# EAGLE schematic UCirKitBreadboardWithEverything2Top (EAGLE 7.3.0)
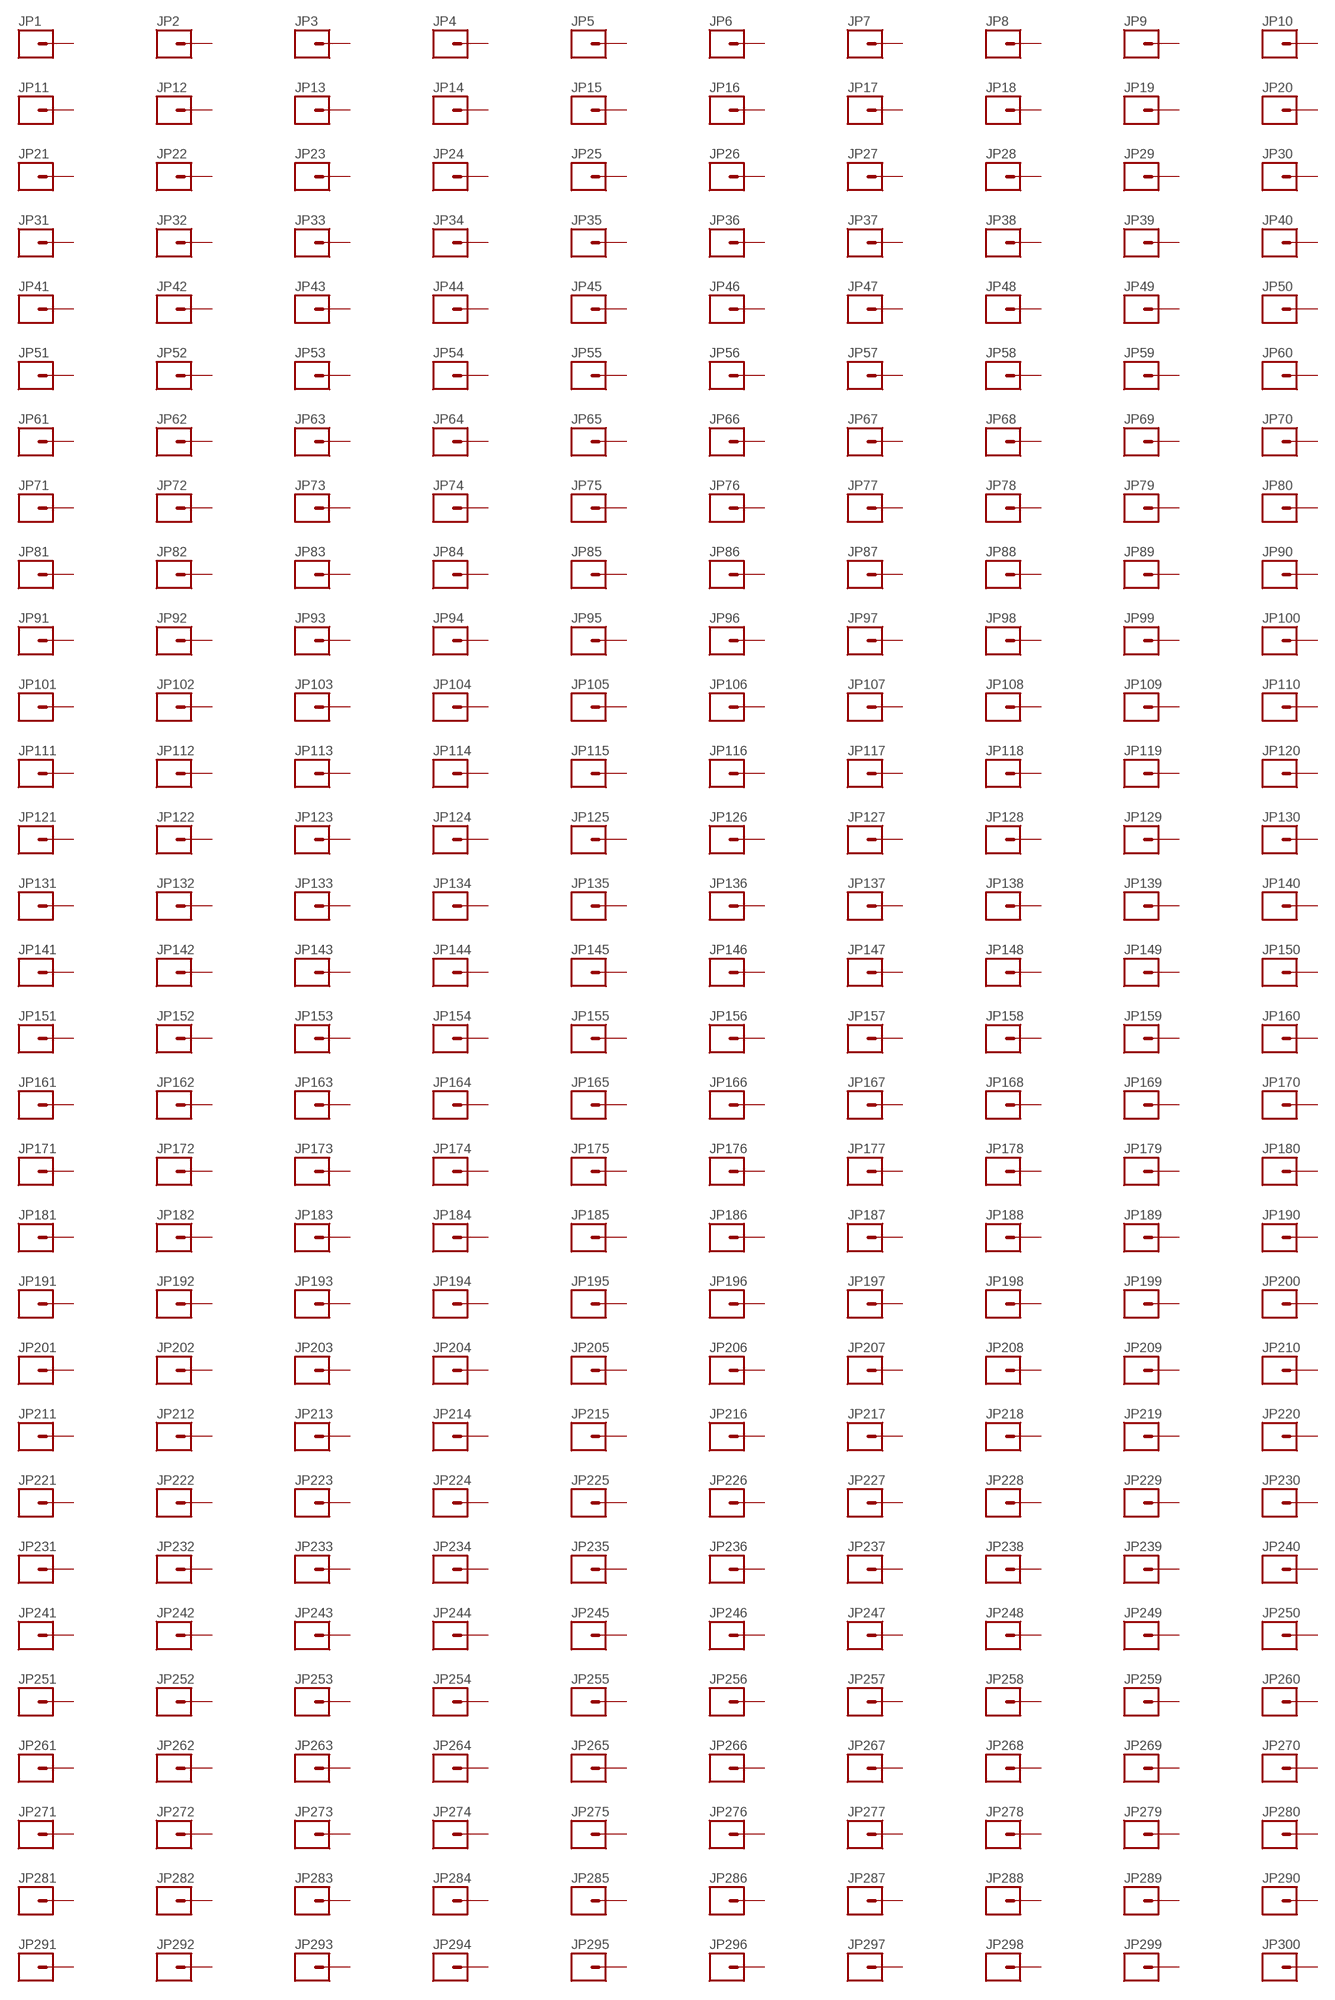
[diagram p0: schematic, sheet 1, part 1 of 2]
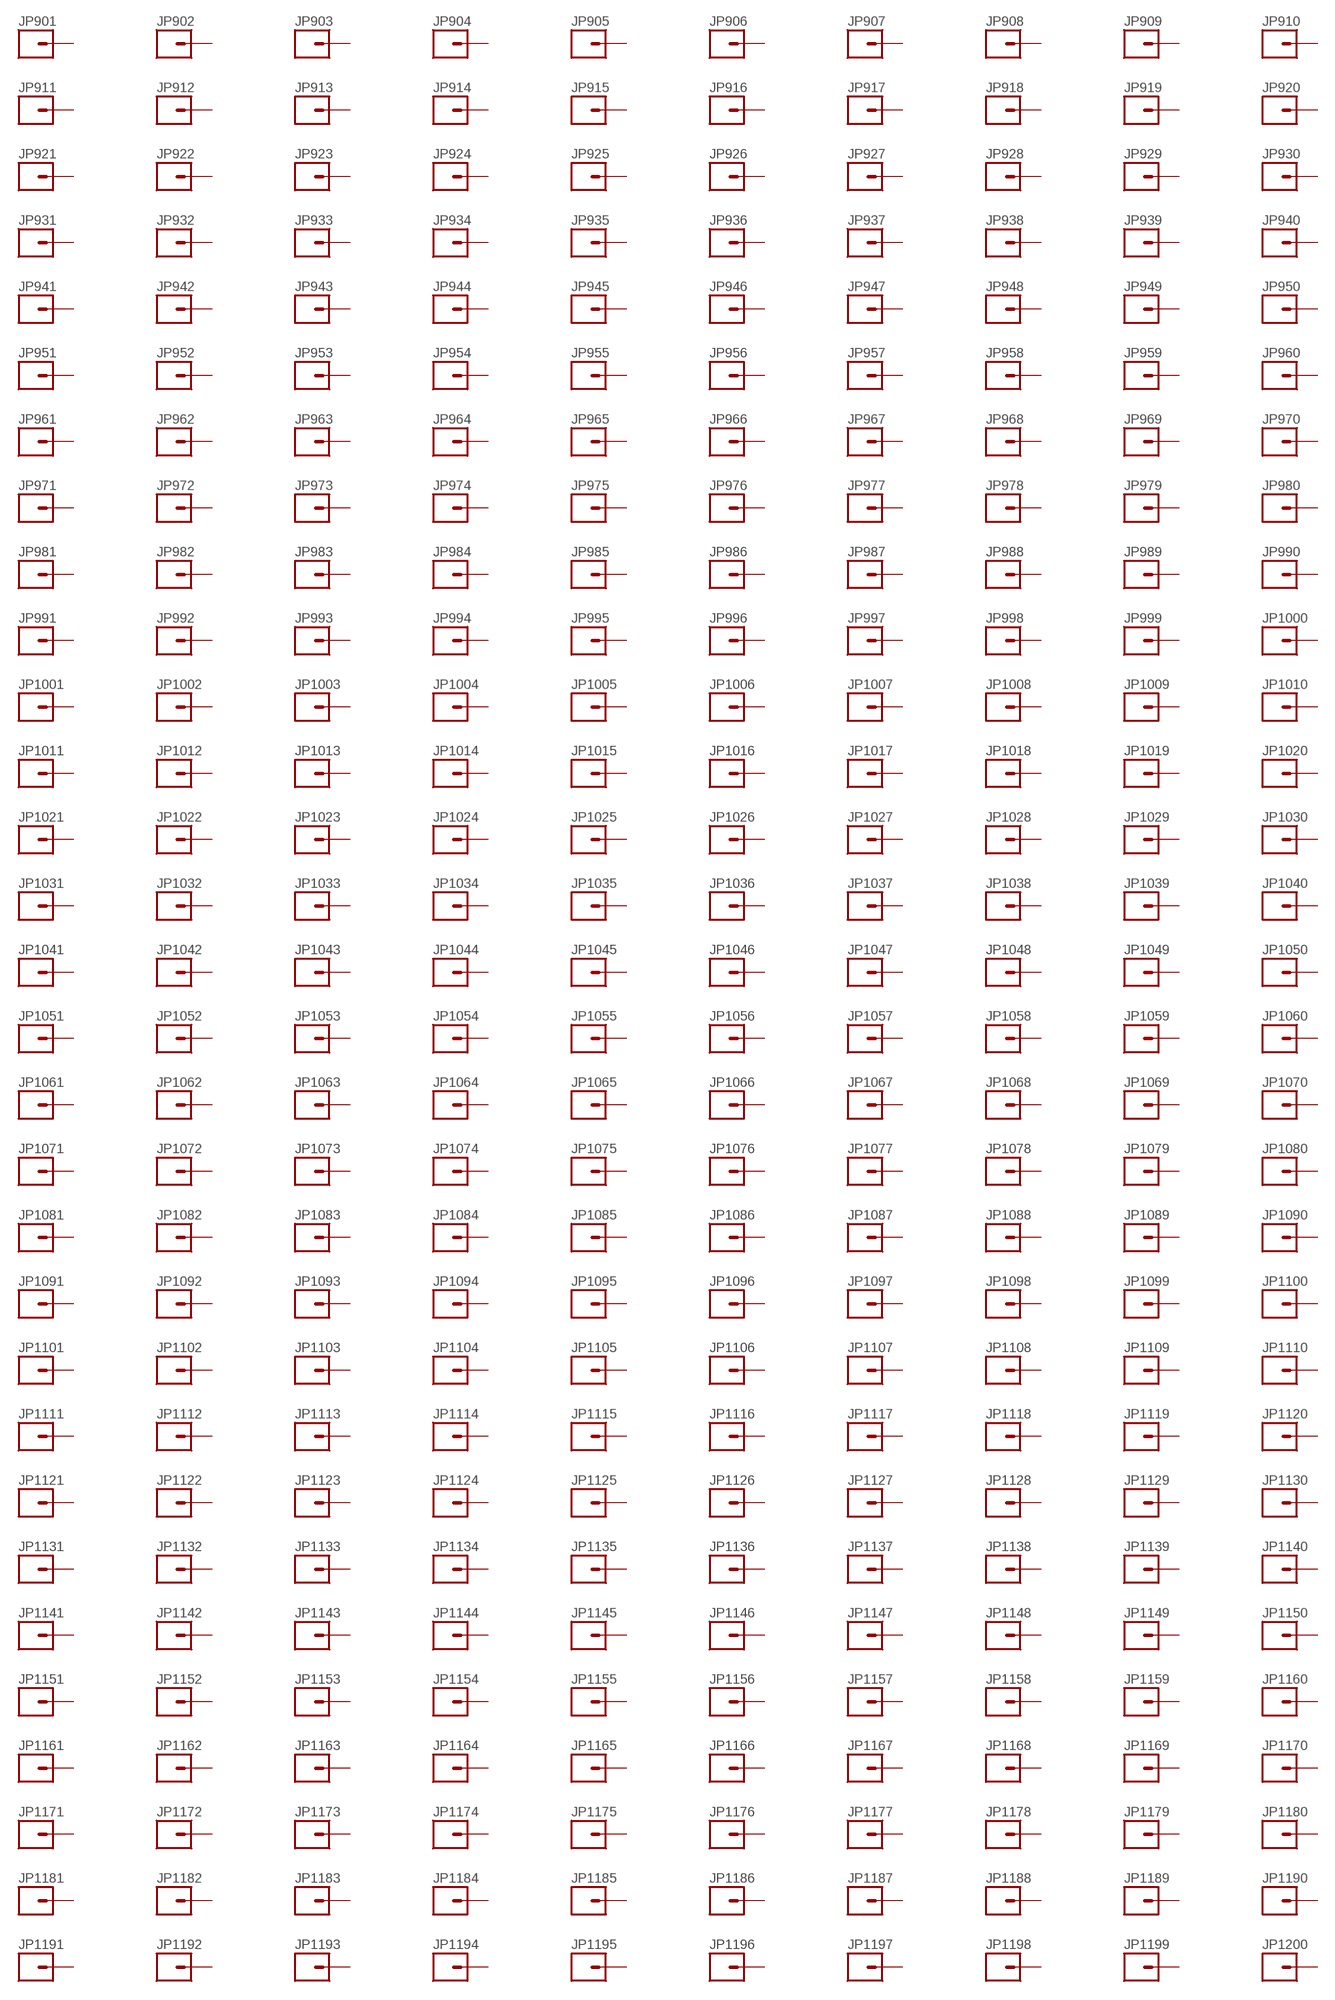
[diagram p1: schematic, sheet 1, part 2 of 2]

## Parts
JP1  M01PTH_WITHOUT_TEXT  [1X01_WITHOUT_TEXT]
JP2  M01PTH_WITHOUT_TEXT  [1X01_WITHOUT_TEXT]
JP3  M01PTH_WITHOUT_TEXT  [1X01_WITHOUT_TEXT]
JP4  M01PTH_WITHOUT_TEXT  [1X01_WITHOUT_TEXT]
JP5  M01PTH_WITHOUT_TEXT  [1X01_WITHOUT_TEXT]
JP6  M01PTH_WITHOUT_TEXT  [1X01_WITHOUT_TEXT]
JP7  M01PTH_WITHOUT_TEXT  [1X01_WITHOUT_TEXT]
JP8  M01PTH_WITHOUT_TEXT  [1X01_WITHOUT_TEXT]
JP9  M01PTH_WITHOUT_TEXT  [1X01_WITHOUT_TEXT]
JP10  M01PTH_WITHOUT_TEXT  [1X01_WITHOUT_TEXT]
JP11  M01PTH_WITHOUT_TEXT  [1X01_WITHOUT_TEXT]
JP12  M01PTH_WITHOUT_TEXT  [1X01_WITHOUT_TEXT]
JP13  M01PTH_WITHOUT_TEXT  [1X01_WITHOUT_TEXT]
JP14  M01PTH_WITHOUT_TEXT  [1X01_WITHOUT_TEXT]
JP15  M01PTH_WITHOUT_TEXT  [1X01_WITHOUT_TEXT]
JP16  M01PTH_WITHOUT_TEXT  [1X01_WITHOUT_TEXT]
JP17  M01PTH_WITHOUT_TEXT  [1X01_WITHOUT_TEXT]
JP18  M01PTH_WITHOUT_TEXT  [1X01_WITHOUT_TEXT]
JP19  M01PTH_WITHOUT_TEXT  [1X01_WITHOUT_TEXT]
JP20  M01PTH_WITHOUT_TEXT  [1X01_WITHOUT_TEXT]
JP21  M01PTH_WITHOUT_TEXT  [1X01_WITHOUT_TEXT]
JP22  M01PTH_WITHOUT_TEXT  [1X01_WITHOUT_TEXT]
JP23  M01PTH_WITHOUT_TEXT  [1X01_WITHOUT_TEXT]
JP24  M01PTH_WITHOUT_TEXT  [1X01_WITHOUT_TEXT]
JP25  M01PTH_WITHOUT_TEXT  [1X01_WITHOUT_TEXT]
JP26  M01PTH_WITHOUT_TEXT  [1X01_WITHOUT_TEXT]
JP27  M01PTH_WITHOUT_TEXT  [1X01_WITHOUT_TEXT]
JP28  M01PTH_WITHOUT_TEXT  [1X01_WITHOUT_TEXT]
JP29  M01PTH_WITHOUT_TEXT  [1X01_WITHOUT_TEXT]
JP30  M01PTH_WITHOUT_TEXT  [1X01_WITHOUT_TEXT]
JP31  M01PTH_WITHOUT_TEXT  [1X01_WITHOUT_TEXT]
JP32  M01PTH_WITHOUT_TEXT  [1X01_WITHOUT_TEXT]
JP33  M01PTH_WITHOUT_TEXT  [1X01_WITHOUT_TEXT]
JP34  M01PTH_WITHOUT_TEXT  [1X01_WITHOUT_TEXT]
JP35  M01PTH_WITHOUT_TEXT  [1X01_WITHOUT_TEXT]
JP36  M01PTH_WITHOUT_TEXT  [1X01_WITHOUT_TEXT]
JP37  M01PTH_WITHOUT_TEXT  [1X01_WITHOUT_TEXT]
JP38  M01PTH_WITHOUT_TEXT  [1X01_WITHOUT_TEXT]
JP39  M01PTH_WITHOUT_TEXT  [1X01_WITHOUT_TEXT]
JP40  M01PTH_WITHOUT_TEXT  [1X01_WITHOUT_TEXT]
JP41  M01PTH_WITHOUT_TEXT  [1X01_WITHOUT_TEXT]
JP42  M01PTH_WITHOUT_TEXT  [1X01_WITHOUT_TEXT]
JP43  M01PTH_WITHOUT_TEXT  [1X01_WITHOUT_TEXT]
JP44  M01PTH_WITHOUT_TEXT  [1X01_WITHOUT_TEXT]
JP45  M01PTH_WITHOUT_TEXT  [1X01_WITHOUT_TEXT]
JP46  M01PTH_WITHOUT_TEXT  [1X01_WITHOUT_TEXT]
JP47  M01PTH_WITHOUT_TEXT  [1X01_WITHOUT_TEXT]
JP48  M01PTH_WITHOUT_TEXT  [1X01_WITHOUT_TEXT]
JP49  M01PTH_WITHOUT_TEXT  [1X01_WITHOUT_TEXT]
JP50  M01PTH_WITHOUT_TEXT  [1X01_WITHOUT_TEXT]
JP51  M01PTH_WITHOUT_TEXT  [1X01_WITHOUT_TEXT]
JP52  M01PTH_WITHOUT_TEXT  [1X01_WITHOUT_TEXT]
JP53  M01PTH_WITHOUT_TEXT  [1X01_WITHOUT_TEXT]
JP54  M01PTH_WITHOUT_TEXT  [1X01_WITHOUT_TEXT]
JP55  M01PTH_WITHOUT_TEXT  [1X01_WITHOUT_TEXT]
JP56  M01PTH_WITHOUT_TEXT  [1X01_WITHOUT_TEXT]
JP57  M01PTH_WITHOUT_TEXT  [1X01_WITHOUT_TEXT]
JP58  M01PTH_WITHOUT_TEXT  [1X01_WITHOUT_TEXT]
JP59  M01PTH_WITHOUT_TEXT  [1X01_WITHOUT_TEXT]
JP60  M01PTH_WITHOUT_TEXT  [1X01_WITHOUT_TEXT]
JP61  M01PTH_WITHOUT_TEXT  [1X01_WITHOUT_TEXT]
JP62  M01PTH_WITHOUT_TEXT  [1X01_WITHOUT_TEXT]
JP63  M01PTH_WITHOUT_TEXT  [1X01_WITHOUT_TEXT]
JP64  M01PTH_WITHOUT_TEXT  [1X01_WITHOUT_TEXT]
JP65  M01PTH_WITHOUT_TEXT  [1X01_WITHOUT_TEXT]
JP66  M01PTH_WITHOUT_TEXT  [1X01_WITHOUT_TEXT]
JP67  M01PTH_WITHOUT_TEXT  [1X01_WITHOUT_TEXT]
JP68  M01PTH_WITHOUT_TEXT  [1X01_WITHOUT_TEXT]
JP69  M01PTH_WITHOUT_TEXT  [1X01_WITHOUT_TEXT]
JP70  M01PTH_WITHOUT_TEXT  [1X01_WITHOUT_TEXT]
JP71  M01PTH_WITHOUT_TEXT  [1X01_WITHOUT_TEXT]
JP72  M01PTH_WITHOUT_TEXT  [1X01_WITHOUT_TEXT]
JP73  M01PTH_WITHOUT_TEXT  [1X01_WITHOUT_TEXT]
JP74  M01PTH_WITHOUT_TEXT  [1X01_WITHOUT_TEXT]
JP75  M01PTH_WITHOUT_TEXT  [1X01_WITHOUT_TEXT]
JP76  M01PTH_WITHOUT_TEXT  [1X01_WITHOUT_TEXT]
JP77  M01PTH_WITHOUT_TEXT  [1X01_WITHOUT_TEXT]
JP78  M01PTH_WITHOUT_TEXT  [1X01_WITHOUT_TEXT]
JP79  M01PTH_WITHOUT_TEXT  [1X01_WITHOUT_TEXT]
JP80  M01PTH_WITHOUT_TEXT  [1X01_WITHOUT_TEXT]
JP81  M01PTH_WITHOUT_TEXT  [1X01_WITHOUT_TEXT]
JP82  M01PTH_WITHOUT_TEXT  [1X01_WITHOUT_TEXT]
JP83  M01PTH_WITHOUT_TEXT  [1X01_WITHOUT_TEXT]
JP84  M01PTH_WITHOUT_TEXT  [1X01_WITHOUT_TEXT]
JP85  M01PTH_WITHOUT_TEXT  [1X01_WITHOUT_TEXT]
JP86  M01PTH_WITHOUT_TEXT  [1X01_WITHOUT_TEXT]
JP87  M01PTH_WITHOUT_TEXT  [1X01_WITHOUT_TEXT]
JP88  M01PTH_WITHOUT_TEXT  [1X01_WITHOUT_TEXT]
JP89  M01PTH_WITHOUT_TEXT  [1X01_WITHOUT_TEXT]
JP90  M01PTH_WITHOUT_TEXT  [1X01_WITHOUT_TEXT]
JP91  M01PTH_WITHOUT_TEXT  [1X01_WITHOUT_TEXT]
JP92  M01PTH_WITHOUT_TEXT  [1X01_WITHOUT_TEXT]
JP93  M01PTH_WITHOUT_TEXT  [1X01_WITHOUT_TEXT]
JP94  M01PTH_WITHOUT_TEXT  [1X01_WITHOUT_TEXT]
JP95  M01PTH_WITHOUT_TEXT  [1X01_WITHOUT_TEXT]
JP96  M01PTH_WITHOUT_TEXT  [1X01_WITHOUT_TEXT]
JP97  M01PTH_WITHOUT_TEXT  [1X01_WITHOUT_TEXT]
JP98  M01PTH_WITHOUT_TEXT  [1X01_WITHOUT_TEXT]
JP99  M01PTH_WITHOUT_TEXT  [1X01_WITHOUT_TEXT]
JP100  M01PTH_WITHOUT_TEXT  [1X01_WITHOUT_TEXT]
JP101  M01PTH_WITHOUT_TEXT  [1X01_WITHOUT_TEXT]
JP102  M01PTH_WITHOUT_TEXT  [1X01_WITHOUT_TEXT]
JP103  M01PTH_WITHOUT_TEXT  [1X01_WITHOUT_TEXT]
JP104  M01PTH_WITHOUT_TEXT  [1X01_WITHOUT_TEXT]
JP105  M01PTH_WITHOUT_TEXT  [1X01_WITHOUT_TEXT]
JP106  M01PTH_WITHOUT_TEXT  [1X01_WITHOUT_TEXT]
JP107  M01PTH_WITHOUT_TEXT  [1X01_WITHOUT_TEXT]
JP108  M01PTH_WITHOUT_TEXT  [1X01_WITHOUT_TEXT]
JP109  M01PTH_WITHOUT_TEXT  [1X01_WITHOUT_TEXT]
JP110  M01PTH_WITHOUT_TEXT  [1X01_WITHOUT_TEXT]
JP111  M01PTH_WITHOUT_TEXT  [1X01_WITHOUT_TEXT]
JP112  M01PTH_WITHOUT_TEXT  [1X01_WITHOUT_TEXT]
JP113  M01PTH_WITHOUT_TEXT  [1X01_WITHOUT_TEXT]
JP114  M01PTH_WITHOUT_TEXT  [1X01_WITHOUT_TEXT]
JP115  M01PTH_WITHOUT_TEXT  [1X01_WITHOUT_TEXT]
JP116  M01PTH_WITHOUT_TEXT  [1X01_WITHOUT_TEXT]
JP117  M01PTH_WITHOUT_TEXT  [1X01_WITHOUT_TEXT]
JP118  M01PTH_WITHOUT_TEXT  [1X01_WITHOUT_TEXT]
JP119  M01PTH_WITHOUT_TEXT  [1X01_WITHOUT_TEXT]
JP120  M01PTH_WITHOUT_TEXT  [1X01_WITHOUT_TEXT]
JP121  M01PTH_WITHOUT_TEXT  [1X01_WITHOUT_TEXT]
JP122  M01PTH_WITHOUT_TEXT  [1X01_WITHOUT_TEXT]
JP123  M01PTH_WITHOUT_TEXT  [1X01_WITHOUT_TEXT]
JP124  M01PTH_WITHOUT_TEXT  [1X01_WITHOUT_TEXT]
JP125  M01PTH_WITHOUT_TEXT  [1X01_WITHOUT_TEXT]
JP126  M01PTH_WITHOUT_TEXT  [1X01_WITHOUT_TEXT]
JP127  M01PTH_WITHOUT_TEXT  [1X01_WITHOUT_TEXT]
JP128  M01PTH_WITHOUT_TEXT  [1X01_WITHOUT_TEXT]
JP129  M01PTH_WITHOUT_TEXT  [1X01_WITHOUT_TEXT]
JP130  M01PTH_WITHOUT_TEXT  [1X01_WITHOUT_TEXT]
JP131  M01PTH_WITHOUT_TEXT  [1X01_WITHOUT_TEXT]
JP132  M01PTH_WITHOUT_TEXT  [1X01_WITHOUT_TEXT]
JP133  M01PTH_WITHOUT_TEXT  [1X01_WITHOUT_TEXT]
JP134  M01PTH_WITHOUT_TEXT  [1X01_WITHOUT_TEXT]
JP135  M01PTH_WITHOUT_TEXT  [1X01_WITHOUT_TEXT]
JP136  M01PTH_WITHOUT_TEXT  [1X01_WITHOUT_TEXT]
JP137  M01PTH_WITHOUT_TEXT  [1X01_WITHOUT_TEXT]
JP138  M01PTH_WITHOUT_TEXT  [1X01_WITHOUT_TEXT]
JP139  M01PTH_WITHOUT_TEXT  [1X01_WITHOUT_TEXT]
JP140  M01PTH_WITHOUT_TEXT  [1X01_WITHOUT_TEXT]
JP141  M01PTH_WITHOUT_TEXT  [1X01_WITHOUT_TEXT]
JP142  M01PTH_WITHOUT_TEXT  [1X01_WITHOUT_TEXT]
JP143  M01PTH_WITHOUT_TEXT  [1X01_WITHOUT_TEXT]
JP144  M01PTH_WITHOUT_TEXT  [1X01_WITHOUT_TEXT]
JP145  M01PTH_WITHOUT_TEXT  [1X01_WITHOUT_TEXT]
JP146  M01PTH_WITHOUT_TEXT  [1X01_WITHOUT_TEXT]
JP147  M01PTH_WITHOUT_TEXT  [1X01_WITHOUT_TEXT]
JP148  M01PTH_WITHOUT_TEXT  [1X01_WITHOUT_TEXT]
JP149  M01PTH_WITHOUT_TEXT  [1X01_WITHOUT_TEXT]
JP150  M01PTH_WITHOUT_TEXT  [1X01_WITHOUT_TEXT]
JP151  M01PTH_WITHOUT_TEXT  [1X01_WITHOUT_TEXT]
JP152  M01PTH_WITHOUT_TEXT  [1X01_WITHOUT_TEXT]
JP153  M01PTH_WITHOUT_TEXT  [1X01_WITHOUT_TEXT]
JP154  M01PTH_WITHOUT_TEXT  [1X01_WITHOUT_TEXT]
JP155  M01PTH_WITHOUT_TEXT  [1X01_WITHOUT_TEXT]
JP156  M01PTH_WITHOUT_TEXT  [1X01_WITHOUT_TEXT]
JP157  M01PTH_WITHOUT_TEXT  [1X01_WITHOUT_TEXT]
JP158  M01PTH_WITHOUT_TEXT  [1X01_WITHOUT_TEXT]
JP159  M01PTH_WITHOUT_TEXT  [1X01_WITHOUT_TEXT]
JP160  M01PTH_WITHOUT_TEXT  [1X01_WITHOUT_TEXT]
JP161  M01PTH_WITHOUT_TEXT  [1X01_WITHOUT_TEXT]
JP162  M01PTH_WITHOUT_TEXT  [1X01_WITHOUT_TEXT]
JP163  M01PTH_WITHOUT_TEXT  [1X01_WITHOUT_TEXT]
JP164  M01PTH_WITHOUT_TEXT  [1X01_WITHOUT_TEXT]
JP165  M01PTH_WITHOUT_TEXT  [1X01_WITHOUT_TEXT]
JP166  M01PTH_WITHOUT_TEXT  [1X01_WITHOUT_TEXT]
JP167  M01PTH_WITHOUT_TEXT  [1X01_WITHOUT_TEXT]
JP168  M01PTH_WITHOUT_TEXT  [1X01_WITHOUT_TEXT]
JP169  M01PTH_WITHOUT_TEXT  [1X01_WITHOUT_TEXT]
JP170  M01PTH_WITHOUT_TEXT  [1X01_WITHOUT_TEXT]
JP171  M01PTH_WITHOUT_TEXT  [1X01_WITHOUT_TEXT]
JP172  M01PTH_WITHOUT_TEXT  [1X01_WITHOUT_TEXT]
JP173  M01PTH_WITHOUT_TEXT  [1X01_WITHOUT_TEXT]
JP174  M01PTH_WITHOUT_TEXT  [1X01_WITHOUT_TEXT]
JP175  M01PTH_WITHOUT_TEXT  [1X01_WITHOUT_TEXT]
JP176  M01PTH_WITHOUT_TEXT  [1X01_WITHOUT_TEXT]
JP177  M01PTH_WITHOUT_TEXT  [1X01_WITHOUT_TEXT]
JP178  M01PTH_WITHOUT_TEXT  [1X01_WITHOUT_TEXT]
JP179  M01PTH_WITHOUT_TEXT  [1X01_WITHOUT_TEXT]
JP180  M01PTH_WITHOUT_TEXT  [1X01_WITHOUT_TEXT]
JP181  M01PTH_WITHOUT_TEXT  [1X01_WITHOUT_TEXT]
JP182  M01PTH_WITHOUT_TEXT  [1X01_WITHOUT_TEXT]
JP183  M01PTH_WITHOUT_TEXT  [1X01_WITHOUT_TEXT]
JP184  M01PTH_WITHOUT_TEXT  [1X01_WITHOUT_TEXT]
JP185  M01PTH_WITHOUT_TEXT  [1X01_WITHOUT_TEXT]
JP186  M01PTH_WITHOUT_TEXT  [1X01_WITHOUT_TEXT]
JP187  M01PTH_WITHOUT_TEXT  [1X01_WITHOUT_TEXT]
JP188  M01PTH_WITHOUT_TEXT  [1X01_WITHOUT_TEXT]
JP189  M01PTH_WITHOUT_TEXT  [1X01_WITHOUT_TEXT]
JP190  M01PTH_WITHOUT_TEXT  [1X01_WITHOUT_TEXT]
JP191  M01PTH_WITHOUT_TEXT  [1X01_WITHOUT_TEXT]
JP192  M01PTH_WITHOUT_TEXT  [1X01_WITHOUT_TEXT]
JP193  M01PTH_WITHOUT_TEXT  [1X01_WITHOUT_TEXT]
JP194  M01PTH_WITHOUT_TEXT  [1X01_WITHOUT_TEXT]
JP195  M01PTH_WITHOUT_TEXT  [1X01_WITHOUT_TEXT]
JP196  M01PTH_WITHOUT_TEXT  [1X01_WITHOUT_TEXT]
JP197  M01PTH_WITHOUT_TEXT  [1X01_WITHOUT_TEXT]
JP198  M01PTH_WITHOUT_TEXT  [1X01_WITHOUT_TEXT]
JP199  M01PTH_WITHOUT_TEXT  [1X01_WITHOUT_TEXT]
JP200  M01PTH_WITHOUT_TEXT  [1X01_WITHOUT_TEXT]
JP201  M01PTH_WITHOUT_TEXT  [1X01_WITHOUT_TEXT]
JP202  M01PTH_WITHOUT_TEXT  [1X01_WITHOUT_TEXT]
JP203  M01PTH_WITHOUT_TEXT  [1X01_WITHOUT_TEXT]
JP204  M01PTH_WITHOUT_TEXT  [1X01_WITHOUT_TEXT]
JP205  M01PTH_WITHOUT_TEXT  [1X01_WITHOUT_TEXT]
JP206  M01PTH_WITHOUT_TEXT  [1X01_WITHOUT_TEXT]
JP207  M01PTH_WITHOUT_TEXT  [1X01_WITHOUT_TEXT]
JP208  M01PTH_WITHOUT_TEXT  [1X01_WITHOUT_TEXT]
JP209  M01PTH_WITHOUT_TEXT  [1X01_WITHOUT_TEXT]
JP210  M01PTH_WITHOUT_TEXT  [1X01_WITHOUT_TEXT]
JP211  M01PTH_WITHOUT_TEXT  [1X01_WITHOUT_TEXT]
JP212  M01PTH_WITHOUT_TEXT  [1X01_WITHOUT_TEXT]
JP213  M01PTH_WITHOUT_TEXT  [1X01_WITHOUT_TEXT]
JP214  M01PTH_WITHOUT_TEXT  [1X01_WITHOUT_TEXT]
JP215  M01PTH_WITHOUT_TEXT  [1X01_WITHOUT_TEXT]
JP216  M01PTH_WITHOUT_TEXT  [1X01_WITHOUT_TEXT]
JP217  M01PTH_WITHOUT_TEXT  [1X01_WITHOUT_TEXT]
JP218  M01PTH_WITHOUT_TEXT  [1X01_WITHOUT_TEXT]
JP219  M01PTH_WITHOUT_TEXT  [1X01_WITHOUT_TEXT]
JP220  M01PTH_WITHOUT_TEXT  [1X01_WITHOUT_TEXT]
JP221  M01PTH_WITHOUT_TEXT  [1X01_WITHOUT_TEXT]
JP222  M01PTH_WITHOUT_TEXT  [1X01_WITHOUT_TEXT]
JP223  M01PTH_WITHOUT_TEXT  [1X01_WITHOUT_TEXT]
JP224  M01PTH_WITHOUT_TEXT  [1X01_WITHOUT_TEXT]
JP225  M01PTH_WITHOUT_TEXT  [1X01_WITHOUT_TEXT]
JP226  M01PTH_WITHOUT_TEXT  [1X01_WITHOUT_TEXT]
JP227  M01PTH_WITHOUT_TEXT  [1X01_WITHOUT_TEXT]
JP228  M01PTH_WITHOUT_TEXT  [1X01_WITHOUT_TEXT]
JP229  M01PTH_WITHOUT_TEXT  [1X01_WITHOUT_TEXT]
JP230  M01PTH_WITHOUT_TEXT  [1X01_WITHOUT_TEXT]
JP231  M01PTH_WITHOUT_TEXT  [1X01_WITHOUT_TEXT]
JP232  M01PTH_WITHOUT_TEXT  [1X01_WITHOUT_TEXT]
JP233  M01PTH_WITHOUT_TEXT  [1X01_WITHOUT_TEXT]
JP234  M01PTH_WITHOUT_TEXT  [1X01_WITHOUT_TEXT]
JP235  M01PTH_WITHOUT_TEXT  [1X01_WITHOUT_TEXT]
JP236  M01PTH_WITHOUT_TEXT  [1X01_WITHOUT_TEXT]
JP237  M01PTH_WITHOUT_TEXT  [1X01_WITHOUT_TEXT]
JP238  M01PTH_WITHOUT_TEXT  [1X01_WITHOUT_TEXT]
JP239  M01PTH_WITHOUT_TEXT  [1X01_WITHOUT_TEXT]
JP240  M01PTH_WITHOUT_TEXT  [1X01_WITHOUT_TEXT]
JP241  M01PTH_WITHOUT_TEXT  [1X01_WITHOUT_TEXT]
JP242  M01PTH_WITHOUT_TEXT  [1X01_WITHOUT_TEXT]
JP243  M01PTH_WITHOUT_TEXT  [1X01_WITHOUT_TEXT]
JP244  M01PTH_WITHOUT_TEXT  [1X01_WITHOUT_TEXT]
JP245  M01PTH_WITHOUT_TEXT  [1X01_WITHOUT_TEXT]
JP246  M01PTH_WITHOUT_TEXT  [1X01_WITHOUT_TEXT]
JP247  M01PTH_WITHOUT_TEXT  [1X01_WITHOUT_TEXT]
JP248  M01PTH_WITHOUT_TEXT  [1X01_WITHOUT_TEXT]
JP249  M01PTH_WITHOUT_TEXT  [1X01_WITHOUT_TEXT]
JP250  M01PTH_WITHOUT_TEXT  [1X01_WITHOUT_TEXT]
JP251  M01PTH_WITHOUT_TEXT  [1X01_WITHOUT_TEXT]
JP252  M01PTH_WITHOUT_TEXT  [1X01_WITHOUT_TEXT]
JP253  M01PTH_WITHOUT_TEXT  [1X01_WITHOUT_TEXT]
JP254  M01PTH_WITHOUT_TEXT  [1X01_WITHOUT_TEXT]
JP255  M01PTH_WITHOUT_TEXT  [1X01_WITHOUT_TEXT]
JP256  M01PTH_WITHOUT_TEXT  [1X01_WITHOUT_TEXT]
JP257  M01PTH_WITHOUT_TEXT  [1X01_WITHOUT_TEXT]
JP258  M01PTH_WITHOUT_TEXT  [1X01_WITHOUT_TEXT]
JP259  M01PTH_WITHOUT_TEXT  [1X01_WITHOUT_TEXT]
JP260  M01PTH_WITHOUT_TEXT  [1X01_WITHOUT_TEXT]
JP261  M01PTH_WITHOUT_TEXT  [1X01_WITHOUT_TEXT]
JP262  M01PTH_WITHOUT_TEXT  [1X01_WITHOUT_TEXT]
JP263  M01PTH_WITHOUT_TEXT  [1X01_WITHOUT_TEXT]
JP264  M01PTH_WITHOUT_TEXT  [1X01_WITHOUT_TEXT]
JP265  M01PTH_WITHOUT_TEXT  [1X01_WITHOUT_TEXT]
JP266  M01PTH_WITHOUT_TEXT  [1X01_WITHOUT_TEXT]
JP267  M01PTH_WITHOUT_TEXT  [1X01_WITHOUT_TEXT]
JP268  M01PTH_WITHOUT_TEXT  [1X01_WITHOUT_TEXT]
JP269  M01PTH_WITHOUT_TEXT  [1X01_WITHOUT_TEXT]
JP270  M01PTH_WITHOUT_TEXT  [1X01_WITHOUT_TEXT]
JP271  M01PTH_WITHOUT_TEXT  [1X01_WITHOUT_TEXT]
JP272  M01PTH_WITHOUT_TEXT  [1X01_WITHOUT_TEXT]
JP273  M01PTH_WITHOUT_TEXT  [1X01_WITHOUT_TEXT]
JP274  M01PTH_WITHOUT_TEXT  [1X01_WITHOUT_TEXT]
JP275  M01PTH_WITHOUT_TEXT  [1X01_WITHOUT_TEXT]
JP276  M01PTH_WITHOUT_TEXT  [1X01_WITHOUT_TEXT]
JP277  M01PTH_WITHOUT_TEXT  [1X01_WITHOUT_TEXT]
JP278  M01PTH_WITHOUT_TEXT  [1X01_WITHOUT_TEXT]
JP279  M01PTH_WITHOUT_TEXT  [1X01_WITHOUT_TEXT]
JP280  M01PTH_WITHOUT_TEXT  [1X01_WITHOUT_TEXT]
JP281  M01PTH_WITHOUT_TEXT  [1X01_WITHOUT_TEXT]
JP282  M01PTH_WITHOUT_TEXT  [1X01_WITHOUT_TEXT]
JP283  M01PTH_WITHOUT_TEXT  [1X01_WITHOUT_TEXT]
JP284  M01PTH_WITHOUT_TEXT  [1X01_WITHOUT_TEXT]
JP285  M01PTH_WITHOUT_TEXT  [1X01_WITHOUT_TEXT]
JP286  M01PTH_WITHOUT_TEXT  [1X01_WITHOUT_TEXT]
JP287  M01PTH_WITHOUT_TEXT  [1X01_WITHOUT_TEXT]
JP288  M01PTH_WITHOUT_TEXT  [1X01_WITHOUT_TEXT]
JP289  M01PTH_WITHOUT_TEXT  [1X01_WITHOUT_TEXT]
JP290  M01PTH_WITHOUT_TEXT  [1X01_WITHOUT_TEXT]
JP291  M01PTH_WITHOUT_TEXT  [1X01_WITHOUT_TEXT]
JP292  M01PTH_WITHOUT_TEXT  [1X01_WITHOUT_TEXT]
JP293  M01PTH_WITHOUT_TEXT  [1X01_WITHOUT_TEXT]
JP294  M01PTH_WITHOUT_TEXT  [1X01_WITHOUT_TEXT]
JP295  M01PTH_WITHOUT_TEXT  [1X01_WITHOUT_TEXT]
JP296  M01PTH_WITHOUT_TEXT  [1X01_WITHOUT_TEXT]
JP297  M01PTH_WITHOUT_TEXT  [1X01_WITHOUT_TEXT]
JP298  M01PTH_WITHOUT_TEXT  [1X01_WITHOUT_TEXT]
JP299  M01PTH_WITHOUT_TEXT  [1X01_WITHOUT_TEXT]
JP300  M01PTH_WITHOUT_TEXT  [1X01_WITHOUT_TEXT]
JP901  M01PTH_SMD_3.25X0.85MM_NO_SILK  [1X01_SMD_3.25X0.85MM_NO_SILK]
JP902  M01PTH_SMD_3.25X0.85MM_NO_SILK  [1X01_SMD_3.25X0.85MM_NO_SILK]
JP903  M01PTH_SMD_3.25X0.85MM_NO_SILK  [1X01_SMD_3.25X0.85MM_NO_SILK]
JP904  M01PTH_SMD_3.25X0.85MM_NO_SILK  [1X01_SMD_3.25X0.85MM_NO_SILK]
JP905  M01PTH_SMD_3.25X0.85MM_NO_SILK  [1X01_SMD_3.25X0.85MM_NO_SILK]
JP906  M01PTH_SMD_3.25X0.85MM_NO_SILK  [1X01_SMD_3.25X0.85MM_NO_SILK]
JP907  M01PTH_SMD_3.25X0.85MM_NO_SILK  [1X01_SMD_3.25X0.85MM_NO_SILK]
JP908  M01PTH_SMD_3.25X0.85MM_NO_SILK  [1X01_SMD_3.25X0.85MM_NO_SILK]
JP909  M01PTH_SMD_3.25X0.85MM_NO_SILK  [1X01_SMD_3.25X0.85MM_NO_SILK]
JP910  M01PTH_SMD_3.25X0.85MM_NO_SILK  [1X01_SMD_3.25X0.85MM_NO_SILK]
JP911  M01PTH_SMD_3.25X0.85MM_NO_SILK  [1X01_SMD_3.25X0.85MM_NO_SILK]
JP912  M01PTH_SMD_3.25X0.85MM_NO_SILK  [1X01_SMD_3.25X0.85MM_NO_SILK]
JP913  M01PTH_SMD_3.25X0.85MM_NO_SILK  [1X01_SMD_3.25X0.85MM_NO_SILK]
JP914  M01PTH_SMD_3.25X0.85MM_NO_SILK  [1X01_SMD_3.25X0.85MM_NO_SILK]
JP915  M01PTH_SMD_3.25X0.85MM_NO_SILK  [1X01_SMD_3.25X0.85MM_NO_SILK]
JP916  M01PTH_SMD_3.25X0.85MM_NO_SILK  [1X01_SMD_3.25X0.85MM_NO_SILK]
JP917  M01PTH_SMD_3.25X0.85MM_NO_SILK  [1X01_SMD_3.25X0.85MM_NO_SILK]
JP918  M01PTH_SMD_3.25X0.85MM_NO_SILK  [1X01_SMD_3.25X0.85MM_NO_SILK]
JP919  M01PTH_SMD_3.25X0.85MM_NO_SILK  [1X01_SMD_3.25X0.85MM_NO_SILK]
JP920  M01PTH_SMD_3.25X0.85MM_NO_SILK  [1X01_SMD_3.25X0.85MM_NO_SILK]
JP921  M01PTH_SMD_3.25X0.85MM_NO_SILK  [1X01_SMD_3.25X0.85MM_NO_SILK]
JP922  M01PTH_SMD_3.25X0.85MM_NO_SILK  [1X01_SMD_3.25X0.85MM_NO_SILK]
JP923  M01PTH_SMD_3.25X0.85MM_NO_SILK  [1X01_SMD_3.25X0.85MM_NO_SILK]
JP924  M01PTH_SMD_3.25X0.85MM_NO_SILK  [1X01_SMD_3.25X0.85MM_NO_SILK]
JP925  M01PTH_SMD_3.25X0.85MM_NO_SILK  [1X01_SMD_3.25X0.85MM_NO_SILK]
JP926  M01PTH_SMD_3.25X0.85MM_NO_SILK  [1X01_SMD_3.25X0.85MM_NO_SILK]
JP927  M01PTH_SMD_3.25X0.85MM_NO_SILK  [1X01_SMD_3.25X0.85MM_NO_SILK]
JP928  M01PTH_SMD_3.25X0.85MM_NO_SILK  [1X01_SMD_3.25X0.85MM_NO_SILK]
JP929  M01PTH_SMD_3.25X0.85MM_NO_SILK  [1X01_SMD_3.25X0.85MM_NO_SILK]
JP930  M01PTH_SMD_3.25X0.85MM_NO_SILK  [1X01_SMD_3.25X0.85MM_NO_SILK]
JP931  M01PTH_SMD_3.25X0.85MM_NO_SILK  [1X01_SMD_3.25X0.85MM_NO_SILK]
JP932  M01PTH_SMD_3.25X0.85MM_NO_SILK  [1X01_SMD_3.25X0.85MM_NO_SILK]
JP933  M01PTH_SMD_3.25X0.85MM_NO_SILK  [1X01_SMD_3.25X0.85MM_NO_SILK]
JP934  M01PTH_SMD_3.25X0.85MM_NO_SILK  [1X01_SMD_3.25X0.85MM_NO_SILK]
JP935  M01PTH_SMD_3.25X0.85MM_NO_SILK  [1X01_SMD_3.25X0.85MM_NO_SILK]
JP936  M01PTH_SMD_3.25X0.85MM_NO_SILK  [1X01_SMD_3.25X0.85MM_NO_SILK]
JP937  M01PTH_SMD_3.25X0.85MM_NO_SILK  [1X01_SMD_3.25X0.85MM_NO_SILK]
JP938  M01PTH_SMD_3.25X0.85MM_NO_SILK  [1X01_SMD_3.25X0.85MM_NO_SILK]
JP939  M01PTH_SMD_3.25X0.85MM_NO_SILK  [1X01_SMD_3.25X0.85MM_NO_SILK]
JP940  M01PTH_SMD_3.25X0.85MM_NO_SILK  [1X01_SMD_3.25X0.85MM_NO_SILK]
JP941  M01PTH_SMD_3.25X0.85MM_NO_SILK  [1X01_SMD_3.25X0.85MM_NO_SILK]
JP942  M01PTH_SMD_3.25X0.85MM_NO_SILK  [1X01_SMD_3.25X0.85MM_NO_SILK]
JP943  M01PTH_SMD_3.25X0.85MM_NO_SILK  [1X01_SMD_3.25X0.85MM_NO_SILK]
JP944  M01PTH_SMD_3.25X0.85MM_NO_SILK  [1X01_SMD_3.25X0.85MM_NO_SILK]
JP945  M01PTH_SMD_3.25X0.85MM_NO_SILK  [1X01_SMD_3.25X0.85MM_NO_SILK]
JP946  M01PTH_SMD_3.25X0.85MM_NO_SILK  [1X01_SMD_3.25X0.85MM_NO_SILK]
JP947  M01PTH_SMD_3.25X0.85MM_NO_SILK  [1X01_SMD_3.25X0.85MM_NO_SILK]
JP948  M01PTH_SMD_3.25X0.85MM_NO_SILK  [1X01_SMD_3.25X0.85MM_NO_SILK]
JP949  M01PTH_SMD_3.25X0.85MM_NO_SILK  [1X01_SMD_3.25X0.85MM_NO_SILK]
JP950  M01PTH_SMD_3.25X0.85MM_NO_SILK  [1X01_SMD_3.25X0.85MM_NO_SILK]
JP951  M01PTH_SMD_3.25X0.85MM_NO_SILK  [1X01_SMD_3.25X0.85MM_NO_SILK]
JP952  M01PTH_SMD_3.25X0.85MM_NO_SILK  [1X01_SMD_3.25X0.85MM_NO_SILK]
JP953  M01PTH_SMD_3.25X0.85MM_NO_SILK  [1X01_SMD_3.25X0.85MM_NO_SILK]
JP954  M01PTH_SMD_3.25X0.85MM_NO_SILK  [1X01_SMD_3.25X0.85MM_NO_SILK]
JP955  M01PTH_SMD_3.25X0.85MM_NO_SILK  [1X01_SMD_3.25X0.85MM_NO_SILK]
JP956  M01PTH_SMD_3.25X0.85MM_NO_SILK  [1X01_SMD_3.25X0.85MM_NO_SILK]
JP957  M01PTH_SMD_3.25X0.85MM_NO_SILK  [1X01_SMD_3.25X0.85MM_NO_SILK]
JP958  M01PTH_SMD_3.25X0.85MM_NO_SILK  [1X01_SMD_3.25X0.85MM_NO_SILK]
JP959  M01PTH_SMD_3.25X0.85MM_NO_SILK  [1X01_SMD_3.25X0.85MM_NO_SILK]
JP960  M01PTH_SMD_3.25X0.85MM_NO_SILK  [1X01_SMD_3.25X0.85MM_NO_SILK]
JP961  M01PTH_SMD_3.25X0.85MM_NO_SILK  [1X01_SMD_3.25X0.85MM_NO_SILK]
JP962  M01PTH_SMD_3.25X0.85MM_NO_SILK  [1X01_SMD_3.25X0.85MM_NO_SILK]
JP963  M01PTH_SMD_3.25X0.85MM_NO_SILK  [1X01_SMD_3.25X0.85MM_NO_SILK]
JP964  M01PTH_SMD_3.25X0.85MM_NO_SILK  [1X01_SMD_3.25X0.85MM_NO_SILK]
JP965  M01PTH_SMD_3.25X0.85MM_NO_SILK  [1X01_SMD_3.25X0.85MM_NO_SILK]
JP966  M01PTH_SMD_3.25X0.85MM_NO_SILK  [1X01_SMD_3.25X0.85MM_NO_SILK]
JP967  M01PTH_SMD_3.25X0.85MM_NO_SILK  [1X01_SMD_3.25X0.85MM_NO_SILK]
JP968  M01PTH_SMD_3.25X0.85MM_NO_SILK  [1X01_SMD_3.25X0.85MM_NO_SILK]
JP969  M01PTH_SMD_3.25X0.85MM_NO_SILK  [1X01_SMD_3.25X0.85MM_NO_SILK]
JP970  M01PTH_SMD_3.25X0.85MM_NO_SILK  [1X01_SMD_3.25X0.85MM_NO_SILK]
JP971  M01PTH_SMD_3.25X0.85MM_NO_SILK  [1X01_SMD_3.25X0.85MM_NO_SILK]
JP972  M01PTH_SMD_3.25X0.85MM_NO_SILK  [1X01_SMD_3.25X0.85MM_NO_SILK]
JP973  M01PTH_SMD_3.25X0.85MM_NO_SILK  [1X01_SMD_3.25X0.85MM_NO_SILK]
JP974  M01PTH_SMD_3.25X0.85MM_NO_SILK  [1X01_SMD_3.25X0.85MM_NO_SILK]
JP975  M01PTH_SMD_3.25X0.85MM_NO_SILK  [1X01_SMD_3.25X0.85MM_NO_SILK]
JP976  M01PTH_SMD_3.25X0.85MM_NO_SILK  [1X01_SMD_3.25X0.85MM_NO_SILK]
JP977  M01PTH_SMD_3.25X0.85MM_NO_SILK  [1X01_SMD_3.25X0.85MM_NO_SILK]
JP978  M01PTH_SMD_3.25X0.85MM_NO_SILK  [1X01_SMD_3.25X0.85MM_NO_SILK]
JP979  M01PTH_SMD_3.25X0.85MM_NO_SILK  [1X01_SMD_3.25X0.85MM_NO_SILK]
JP980  M01PTH_SMD_3.25X0.85MM_NO_SILK  [1X01_SMD_3.25X0.85MM_NO_SILK]
JP981  M01PTH_SMD_3.25X0.85MM_NO_SILK  [1X01_SMD_3.25X0.85MM_NO_SILK]
JP982  M01PTH_SMD_3.25X0.85MM_NO_SILK  [1X01_SMD_3.25X0.85MM_NO_SILK]
JP983  M01PTH_SMD_3.25X0.85MM_NO_SILK  [1X01_SMD_3.25X0.85MM_NO_SILK]
JP984  M01PTH_SMD_3.25X0.85MM_NO_SILK  [1X01_SMD_3.25X0.85MM_NO_SILK]
JP985  M01PTH_SMD_3.25X0.85MM_NO_SILK  [1X01_SMD_3.25X0.85MM_NO_SILK]
JP986  M01PTH_SMD_3.25X0.85MM_NO_SILK  [1X01_SMD_3.25X0.85MM_NO_SILK]
JP987  M01PTH_SMD_3.25X0.85MM_NO_SILK  [1X01_SMD_3.25X0.85MM_NO_SILK]
JP988  M01PTH_SMD_3.25X0.85MM_NO_SILK  [1X01_SMD_3.25X0.85MM_NO_SILK]
JP989  M01PTH_SMD_3.25X0.85MM_NO_SILK  [1X01_SMD_3.25X0.85MM_NO_SILK]
JP990  M01PTH_SMD_3.25X0.85MM_NO_SILK  [1X01_SMD_3.25X0.85MM_NO_SILK]
JP991  M01PTH_SMD_3.25X0.85MM_NO_SILK  [1X01_SMD_3.25X0.85MM_NO_SILK]
JP992  M01PTH_SMD_3.25X0.85MM_NO_SILK  [1X01_SMD_3.25X0.85MM_NO_SILK]
JP993  M01PTH_SMD_3.25X0.85MM_NO_SILK  [1X01_SMD_3.25X0.85MM_NO_SILK]
JP994  M01PTH_SMD_3.25X0.85MM_NO_SILK  [1X01_SMD_3.25X0.85MM_NO_SILK]
JP995  M01PTH_SMD_3.25X0.85MM_NO_SILK  [1X01_SMD_3.25X0.85MM_NO_SILK]
JP996  M01PTH_SMD_3.25X0.85MM_NO_SILK  [1X01_SMD_3.25X0.85MM_NO_SILK]
JP997  M01PTH_SMD_3.25X0.85MM_NO_SILK  [1X01_SMD_3.25X0.85MM_NO_SILK]
JP998  M01PTH_SMD_3.25X0.85MM_NO_SILK  [1X01_SMD_3.25X0.85MM_NO_SILK]
JP999  M01PTH_SMD_3.25X0.85MM_NO_SILK  [1X01_SMD_3.25X0.85MM_NO_SILK]
JP1000  M01PTH_SMD_3.25X0.85MM_NO_SILK  [1X01_SMD_3.25X0.85MM_NO_SILK]
JP1001  M01PTH_SMD_3.25X0.85MM_NO_SILK  [1X01_SMD_3.25X0.85MM_NO_SILK]
JP1002  M01PTH_SMD_3.25X0.85MM_NO_SILK  [1X01_SMD_3.25X0.85MM_NO_SILK]
JP1003  M01PTH_SMD_3.25X0.85MM_NO_SILK  [1X01_SMD_3.25X0.85MM_NO_SILK]
JP1004  M01PTH_SMD_3.25X0.85MM_NO_SILK  [1X01_SMD_3.25X0.85MM_NO_SILK]
JP1005  M01PTH_SMD_3.25X0.85MM_NO_SILK  [1X01_SMD_3.25X0.85MM_NO_SILK]
JP1006  M01PTH_SMD_3.25X0.85MM_NO_SILK  [1X01_SMD_3.25X0.85MM_NO_SILK]
JP1007  M01PTH_SMD_3.25X0.85MM_NO_SILK  [1X01_SMD_3.25X0.85MM_NO_SILK]
JP1008  M01PTH_SMD_3.25X0.85MM_NO_SILK  [1X01_SMD_3.25X0.85MM_NO_SILK]
JP1009  M01PTH_SMD_3.25X0.85MM_NO_SILK  [1X01_SMD_3.25X0.85MM_NO_SILK]
JP1010  M01PTH_SMD_3.25X0.85MM_NO_SILK  [1X01_SMD_3.25X0.85MM_NO_SILK]
JP1011  M01PTH_SMD_3.25X0.85MM_NO_SILK  [1X01_SMD_3.25X0.85MM_NO_SILK]
JP1012  M01PTH_SMD_3.25X0.85MM_NO_SILK  [1X01_SMD_3.25X0.85MM_NO_SILK]
JP1013  M01PTH_SMD_3.25X0.85MM_NO_SILK  [1X01_SMD_3.25X0.85MM_NO_SILK]
JP1014  M01PTH_SMD_3.25X0.85MM_NO_SILK  [1X01_SMD_3.25X0.85MM_NO_SILK]
JP1015  M01PTH_SMD_3.25X0.85MM_NO_SILK  [1X01_SMD_3.25X0.85MM_NO_SILK]
JP1016  M01PTH_SMD_3.25X0.85MM_NO_SILK  [1X01_SMD_3.25X0.85MM_NO_SILK]
JP1017  M01PTH_SMD_3.25X0.85MM_NO_SILK  [1X01_SMD_3.25X0.85MM_NO_SILK]
JP1018  M01PTH_SMD_3.25X0.85MM_NO_SILK  [1X01_SMD_3.25X0.85MM_NO_SILK]
JP1019  M01PTH_SMD_3.25X0.85MM_NO_SILK  [1X01_SMD_3.25X0.85MM_NO_SILK]
JP1020  M01PTH_SMD_3.25X0.85MM_NO_SILK  [1X01_SMD_3.25X0.85MM_NO_SILK]
JP1021  M01PTH_SMD_3.25X0.85MM_NO_SILK  [1X01_SMD_3.25X0.85MM_NO_SILK]
JP1022  M01PTH_SMD_3.25X0.85MM_NO_SILK  [1X01_SMD_3.25X0.85MM_NO_SILK]
JP1023  M01PTH_SMD_3.25X0.85MM_NO_SILK  [1X01_SMD_3.25X0.85MM_NO_SILK]
JP1024  M01PTH_SMD_3.25X0.85MM_NO_SILK  [1X01_SMD_3.25X0.85MM_NO_SILK]
JP1025  M01PTH_SMD_3.25X0.85MM_NO_SILK  [1X01_SMD_3.25X0.85MM_NO_SILK]
JP1026  M01PTH_SMD_3.25X0.85MM_NO_SILK  [1X01_SMD_3.25X0.85MM_NO_SILK]
JP1027  M01PTH_SMD_3.25X0.85MM_NO_SILK  [1X01_SMD_3.25X0.85MM_NO_SILK]
JP1028  M01PTH_SMD_3.25X0.85MM_NO_SILK  [1X01_SMD_3.25X0.85MM_NO_SILK]
JP1029  M01PTH_SMD_3.25X0.85MM_NO_SILK  [1X01_SMD_3.25X0.85MM_NO_SILK]
JP1030  M01PTH_SMD_3.25X0.85MM_NO_SILK  [1X01_SMD_3.25X0.85MM_NO_SILK]
JP1031  M01PTH_SMD_3.25X0.85MM_NO_SILK  [1X01_SMD_3.25X0.85MM_NO_SILK]
JP1032  M01PTH_SMD_3.25X0.85MM_NO_SILK  [1X01_SMD_3.25X0.85MM_NO_SILK]
JP1033  M01PTH_SMD_3.25X0.85MM_NO_SILK  [1X01_SMD_3.25X0.85MM_NO_SILK]
JP1034  M01PTH_SMD_3.25X0.85MM_NO_SILK  [1X01_SMD_3.25X0.85MM_NO_SILK]
JP1035  M01PTH_SMD_3.25X0.85MM_NO_SILK  [1X01_SMD_3.25X0.85MM_NO_SILK]
JP1036  M01PTH_SMD_3.25X0.85MM_NO_SILK  [1X01_SMD_3.25X0.85MM_NO_SILK]
JP1037  M01PTH_SMD_3.25X0.85MM_NO_SILK  [1X01_SMD_3.25X0.85MM_NO_SILK]
JP1038  M01PTH_SMD_3.25X0.85MM_NO_SILK  [1X01_SMD_3.25X0.85MM_NO_SILK]
JP1039  M01PTH_SMD_3.25X0.85MM_NO_SILK  [1X01_SMD_3.25X0.85MM_NO_SILK]
JP1040  M01PTH_SMD_3.25X0.85MM_NO_SILK  [1X01_SMD_3.25X0.85MM_NO_SILK]
JP1041  M01PTH_SMD_3.25X0.85MM_NO_SILK  [1X01_SMD_3.25X0.85MM_NO_SILK]
JP1042  M01PTH_SMD_3.25X0.85MM_NO_SILK  [1X01_SMD_3.25X0.85MM_NO_SILK]
JP1043  M01PTH_SMD_3.25X0.85MM_NO_SILK  [1X01_SMD_3.25X0.85MM_NO_SILK]
JP1044  M01PTH_SMD_3.25X0.85MM_NO_SILK  [1X01_SMD_3.25X0.85MM_NO_SILK]
JP1045  M01PTH_SMD_3.25X0.85MM_NO_SILK  [1X01_SMD_3.25X0.85MM_NO_SILK]
JP1046  M01PTH_SMD_3.25X0.85MM_NO_SILK  [1X01_SMD_3.25X0.85MM_NO_SILK]
JP1047  M01PTH_SMD_3.25X0.85MM_NO_SILK  [1X01_SMD_3.25X0.85MM_NO_SILK]
JP1048  M01PTH_SMD_3.25X0.85MM_NO_SILK  [1X01_SMD_3.25X0.85MM_NO_SILK]
JP1049  M01PTH_SMD_3.25X0.85MM_NO_SILK  [1X01_SMD_3.25X0.85MM_NO_SILK]
JP1050  M01PTH_SMD_3.25X0.85MM_NO_SILK  [1X01_SMD_3.25X0.85MM_NO_SILK]
JP1051  M01PTH_SMD_3.25X0.85MM_NO_SILK  [1X01_SMD_3.25X0.85MM_NO_SILK]
JP1052  M01PTH_SMD_3.25X0.85MM_NO_SILK  [1X01_SMD_3.25X0.85MM_NO_SILK]
JP1053  M01PTH_SMD_3.25X0.85MM_NO_SILK  [1X01_SMD_3.25X0.85MM_NO_SILK]
JP1054  M01PTH_SMD_3.25X0.85MM_NO_SILK  [1X01_SMD_3.25X0.85MM_NO_SILK]
JP1055  M01PTH_SMD_3.25X0.85MM_NO_SILK  [1X01_SMD_3.25X0.85MM_NO_SILK]
JP1056  M01PTH_SMD_3.25X0.85MM_NO_SILK  [1X01_SMD_3.25X0.85MM_NO_SILK]
JP1057  M01PTH_SMD_3.25X0.85MM_NO_SILK  [1X01_SMD_3.25X0.85MM_NO_SILK]
JP1058  M01PTH_SMD_3.25X0.85MM_NO_SILK  [1X01_SMD_3.25X0.85MM_NO_SILK]
JP1059  M01PTH_SMD_3.25X0.85MM_NO_SILK  [1X01_SMD_3.25X0.85MM_NO_SILK]
JP1060  M01PTH_SMD_3.25X0.85MM_NO_SILK  [1X01_SMD_3.25X0.85MM_NO_SILK]
JP1061  M01PTH_SMD_3.25X0.85MM_NO_SILK  [1X01_SMD_3.25X0.85MM_NO_SILK]
JP1062  M01PTH_SMD_3.25X0.85MM_NO_SILK  [1X01_SMD_3.25X0.85MM_NO_SILK]
JP1063  M01PTH_SMD_3.25X0.85MM_NO_SILK  [1X01_SMD_3.25X0.85MM_NO_SILK]
JP1064  M01PTH_SMD_3.25X0.85MM_NO_SILK  [1X01_SMD_3.25X0.85MM_NO_SILK]
JP1065  M01PTH_SMD_3.25X0.85MM_NO_SILK  [1X01_SMD_3.25X0.85MM_NO_SILK]
JP1066  M01PTH_SMD_3.25X0.85MM_NO_SILK  [1X01_SMD_3.25X0.85MM_NO_SILK]
JP1067  M01PTH_SMD_3.25X0.85MM_NO_SILK  [1X01_SMD_3.25X0.85MM_NO_SILK]
JP1068  M01PTH_SMD_3.25X0.85MM_NO_SILK  [1X01_SMD_3.25X0.85MM_NO_SILK]
JP1069  M01PTH_SMD_3.25X0.85MM_NO_SILK  [1X01_SMD_3.25X0.85MM_NO_SILK]
JP1070  M01PTH_SMD_3.25X0.85MM_NO_SILK  [1X01_SMD_3.25X0.85MM_NO_SILK]
JP1071  M01PTH_SMD_3.25X0.85MM_NO_SILK  [1X01_SMD_3.25X0.85MM_NO_SILK]
JP1072  M01PTH_SMD_3.25X0.85MM_NO_SILK  [1X01_SMD_3.25X0.85MM_NO_SILK]
JP1073  M01PTH_SMD_3.25X0.85MM_NO_SILK  [1X01_SMD_3.25X0.85MM_NO_SILK]
JP1074  M01PTH_SMD_3.25X0.85MM_NO_SILK  [1X01_SMD_3.25X0.85MM_NO_SILK]
JP1075  M01PTH_SMD_3.25X0.85MM_NO_SILK  [1X01_SMD_3.25X0.85MM_NO_SILK]
JP1076  M01PTH_SMD_3.25X0.85MM_NO_SILK  [1X01_SMD_3.25X0.85MM_NO_SILK]
JP1077  M01PTH_SMD_3.25X0.85MM_NO_SILK  [1X01_SMD_3.25X0.85MM_NO_SILK]
JP1078  M01PTH_SMD_3.25X0.85MM_NO_SILK  [1X01_SMD_3.25X0.85MM_NO_SILK]
JP1079  M01PTH_SMD_3.25X0.85MM_NO_SILK  [1X01_SMD_3.25X0.85MM_NO_SILK]
JP1080  M01PTH_SMD_3.25X0.85MM_NO_SILK  [1X01_SMD_3.25X0.85MM_NO_SILK]
JP1081  M01PTH_SMD_3.25X0.85MM_NO_SILK  [1X01_SMD_3.25X0.85MM_NO_SILK]
JP1082  M01PTH_SMD_3.25X0.85MM_NO_SILK  [1X01_SMD_3.25X0.85MM_NO_SILK]
JP1083  M01PTH_SMD_3.25X0.85MM_NO_SILK  [1X01_SMD_3.25X0.85MM_NO_SILK]
JP1084  M01PTH_SMD_3.25X0.85MM_NO_SILK  [1X01_SMD_3.25X0.85MM_NO_SILK]
JP1085  M01PTH_SMD_3.25X0.85MM_NO_SILK  [1X01_SMD_3.25X0.85MM_NO_SILK]
JP1086  M01PTH_SMD_3.25X0.85MM_NO_SILK  [1X01_SMD_3.25X0.85MM_NO_SILK]
JP1087  M01PTH_SMD_3.25X0.85MM_NO_SILK  [1X01_SMD_3.25X0.85MM_NO_SILK]
JP1088  M01PTH_SMD_3.25X0.85MM_NO_SILK  [1X01_SMD_3.25X0.85MM_NO_SILK]
JP1089  M01PTH_SMD_3.25X0.85MM_NO_SILK  [1X01_SMD_3.25X0.85MM_NO_SILK]
JP1090  M01PTH_SMD_3.25X0.85MM_NO_SILK  [1X01_SMD_3.25X0.85MM_NO_SILK]
JP1091  M01PTH_SMD_3.25X0.85MM_NO_SILK  [1X01_SMD_3.25X0.85MM_NO_SILK]
JP1092  M01PTH_SMD_3.25X0.85MM_NO_SILK  [1X01_SMD_3.25X0.85MM_NO_SILK]
JP1093  M01PTH_SMD_3.25X0.85MM_NO_SILK  [1X01_SMD_3.25X0.85MM_NO_SILK]
JP1094  M01PTH_SMD_3.25X0.85MM_NO_SILK  [1X01_SMD_3.25X0.85MM_NO_SILK]
JP1095  M01PTH_SMD_3.25X0.85MM_NO_SILK  [1X01_SMD_3.25X0.85MM_NO_SILK]
JP1096  M01PTH_SMD_3.25X0.85MM_NO_SILK  [1X01_SMD_3.25X0.85MM_NO_SILK]
JP1097  M01PTH_SMD_3.25X0.85MM_NO_SILK  [1X01_SMD_3.25X0.85MM_NO_SILK]
JP1098  M01PTH_SMD_3.25X0.85MM_NO_SILK  [1X01_SMD_3.25X0.85MM_NO_SILK]
JP1099  M01PTH_SMD_3.25X0.85MM_NO_SILK  [1X01_SMD_3.25X0.85MM_NO_SILK]
JP1100  M01PTH_SMD_3.25X0.85MM_NO_SILK  [1X01_SMD_3.25X0.85MM_NO_SILK]
JP1101  M01PTH_SMD_3.25X0.85MM_NO_SILK  [1X01_SMD_3.25X0.85MM_NO_SILK]
JP1102  M01PTH_SMD_3.25X0.85MM_NO_SILK  [1X01_SMD_3.25X0.85MM_NO_SILK]
JP1103  M01PTH_SMD_3.25X0.85MM_NO_SILK  [1X01_SMD_3.25X0.85MM_NO_SILK]
JP1104  M01PTH_SMD_3.25X0.85MM_NO_SILK  [1X01_SMD_3.25X0.85MM_NO_SILK]
JP1105  M01PTH_SMD_3.25X0.85MM_NO_SILK  [1X01_SMD_3.25X0.85MM_NO_SILK]
JP1106  M01PTH_SMD_3.25X0.85MM_NO_SILK  [1X01_SMD_3.25X0.85MM_NO_SILK]
JP1107  M01PTH_SMD_3.25X0.85MM_NO_SILK  [1X01_SMD_3.25X0.85MM_NO_SILK]
JP1108  M01PTH_SMD_3.25X0.85MM_NO_SILK  [1X01_SMD_3.25X0.85MM_NO_SILK]
JP1109  M01PTH_SMD_3.25X0.85MM_NO_SILK  [1X01_SMD_3.25X0.85MM_NO_SILK]
JP1110  M01PTH_SMD_3.25X0.85MM_NO_SILK  [1X01_SMD_3.25X0.85MM_NO_SILK]
JP1111  M01PTH_SMD_3.25X0.85MM_NO_SILK  [1X01_SMD_3.25X0.85MM_NO_SILK]
JP1112  M01PTH_SMD_3.25X0.85MM_NO_SILK  [1X01_SMD_3.25X0.85MM_NO_SILK]
JP1113  M01PTH_SMD_3.25X0.85MM_NO_SILK  [1X01_SMD_3.25X0.85MM_NO_SILK]
JP1114  M01PTH_SMD_3.25X0.85MM_NO_SILK  [1X01_SMD_3.25X0.85MM_NO_SILK]
JP1115  M01PTH_SMD_3.25X0.85MM_NO_SILK  [1X01_SMD_3.25X0.85MM_NO_SILK]
JP1116  M01PTH_SMD_3.25X0.85MM_NO_SILK  [1X01_SMD_3.25X0.85MM_NO_SILK]
JP1117  M01PTH_SMD_3.25X0.85MM_NO_SILK  [1X01_SMD_3.25X0.85MM_NO_SILK]
JP1118  M01PTH_SMD_3.25X0.85MM_NO_SILK  [1X01_SMD_3.25X0.85MM_NO_SILK]
JP1119  M01PTH_SMD_3.25X0.85MM_NO_SILK  [1X01_SMD_3.25X0.85MM_NO_SILK]
JP1120  M01PTH_SMD_3.25X0.85MM_NO_SILK  [1X01_SMD_3.25X0.85MM_NO_SILK]
JP1121  M01PTH_SMD_3.25X0.85MM_NO_SILK  [1X01_SMD_3.25X0.85MM_NO_SILK]
JP1122  M01PTH_SMD_3.25X0.85MM_NO_SILK  [1X01_SMD_3.25X0.85MM_NO_SILK]
JP1123  M01PTH_SMD_3.25X0.85MM_NO_SILK  [1X01_SMD_3.25X0.85MM_NO_SILK]
JP1124  M01PTH_SMD_3.25X0.85MM_NO_SILK  [1X01_SMD_3.25X0.85MM_NO_SILK]
JP1125  M01PTH_SMD_3.25X0.85MM_NO_SILK  [1X01_SMD_3.25X0.85MM_NO_SILK]
JP1126  M01PTH_SMD_3.25X0.85MM_NO_SILK  [1X01_SMD_3.25X0.85MM_NO_SILK]
JP1127  M01PTH_SMD_3.25X0.85MM_NO_SILK  [1X01_SMD_3.25X0.85MM_NO_SILK]
JP1128  M01PTH_SMD_3.25X0.85MM_NO_SILK  [1X01_SMD_3.25X0.85MM_NO_SILK]
JP1129  M01PTH_SMD_3.25X0.85MM_NO_SILK  [1X01_SMD_3.25X0.85MM_NO_SILK]
JP1130  M01PTH_SMD_3.25X0.85MM_NO_SILK  [1X01_SMD_3.25X0.85MM_NO_SILK]
JP1131  M01PTH_SMD_3.25X0.85MM_NO_SILK  [1X01_SMD_3.25X0.85MM_NO_SILK]
JP1132  M01PTH_SMD_3.25X0.85MM_NO_SILK  [1X01_SMD_3.25X0.85MM_NO_SILK]
JP1133  M01PTH_SMD_3.25X0.85MM_NO_SILK  [1X01_SMD_3.25X0.85MM_NO_SILK]
JP1134  M01PTH_SMD_3.25X0.85MM_NO_SILK  [1X01_SMD_3.25X0.85MM_NO_SILK]
JP1135  M01PTH_SMD_3.25X0.85MM_NO_SILK  [1X01_SMD_3.25X0.85MM_NO_SILK]
JP1136  M01PTH_SMD_3.25X0.85MM_NO_SILK  [1X01_SMD_3.25X0.85MM_NO_SILK]
JP1137  M01PTH_SMD_3.25X0.85MM_NO_SILK  [1X01_SMD_3.25X0.85MM_NO_SILK]
JP1138  M01PTH_SMD_3.25X0.85MM_NO_SILK  [1X01_SMD_3.25X0.85MM_NO_SILK]
JP1139  M01PTH_SMD_3.25X0.85MM_NO_SILK  [1X01_SMD_3.25X0.85MM_NO_SILK]
JP1140  M01PTH_SMD_3.25X0.85MM_NO_SILK  [1X01_SMD_3.25X0.85MM_NO_SILK]
JP1141  M01PTH_SMD_3.25X0.85MM_NO_SILK  [1X01_SMD_3.25X0.85MM_NO_SILK]
JP1142  M01PTH_SMD_3.25X0.85MM_NO_SILK  [1X01_SMD_3.25X0.85MM_NO_SILK]
JP1143  M01PTH_SMD_3.25X0.85MM_NO_SILK  [1X01_SMD_3.25X0.85MM_NO_SILK]
JP1144  M01PTH_SMD_3.25X0.85MM_NO_SILK  [1X01_SMD_3.25X0.85MM_NO_SILK]
JP1145  M01PTH_SMD_3.25X0.85MM_NO_SILK  [1X01_SMD_3.25X0.85MM_NO_SILK]
JP1146  M01PTH_SMD_3.25X0.85MM_NO_SILK  [1X01_SMD_3.25X0.85MM_NO_SILK]
JP1147  M01PTH_SMD_3.25X0.85MM_NO_SILK  [1X01_SMD_3.25X0.85MM_NO_SILK]
JP1148  M01PTH_SMD_3.25X0.85MM_NO_SILK  [1X01_SMD_3.25X0.85MM_NO_SILK]
JP1149  M01PTH_SMD_3.25X0.85MM_NO_SILK  [1X01_SMD_3.25X0.85MM_NO_SILK]
JP1150  M01PTH_SMD_3.25X0.85MM_NO_SILK  [1X01_SMD_3.25X0.85MM_NO_SILK]
JP1151  M01PTH_SMD_3.25X0.85MM_NO_SILK  [1X01_SMD_3.25X0.85MM_NO_SILK]
JP1152  M01PTH_SMD_3.25X0.85MM_NO_SILK  [1X01_SMD_3.25X0.85MM_NO_SILK]
JP1153  M01PTH_SMD_3.25X0.85MM_NO_SILK  [1X01_SMD_3.25X0.85MM_NO_SILK]
JP1154  M01PTH_SMD_3.25X0.85MM_NO_SILK  [1X01_SMD_3.25X0.85MM_NO_SILK]
JP1155  M01PTH_SMD_3.25X0.85MM_NO_SILK  [1X01_SMD_3.25X0.85MM_NO_SILK]
JP1156  M01PTH_SMD_3.25X0.85MM_NO_SILK  [1X01_SMD_3.25X0.85MM_NO_SILK]
JP1157  M01PTH_SMD_3.25X0.85MM_NO_SILK  [1X01_SMD_3.25X0.85MM_NO_SILK]
JP1158  M01PTH_SMD_3.25X0.85MM_NO_SILK  [1X01_SMD_3.25X0.85MM_NO_SILK]
JP1159  M01PTH_SMD_3.25X0.85MM_NO_SILK  [1X01_SMD_3.25X0.85MM_NO_SILK]
JP1160  M01PTH_SMD_3.25X0.85MM_NO_SILK  [1X01_SMD_3.25X0.85MM_NO_SILK]
JP1161  M01PTH_SMD_3.25X0.85MM_NO_SILK  [1X01_SMD_3.25X0.85MM_NO_SILK]
JP1162  M01PTH_SMD_3.25X0.85MM_NO_SILK  [1X01_SMD_3.25X0.85MM_NO_SILK]
JP1163  M01PTH_SMD_3.25X0.85MM_NO_SILK  [1X01_SMD_3.25X0.85MM_NO_SILK]
JP1164  M01PTH_SMD_3.25X0.85MM_NO_SILK  [1X01_SMD_3.25X0.85MM_NO_SILK]
JP1165  M01PTH_SMD_3.25X0.85MM_NO_SILK  [1X01_SMD_3.25X0.85MM_NO_SILK]
JP1166  M01PTH_SMD_3.25X0.85MM_NO_SILK  [1X01_SMD_3.25X0.85MM_NO_SILK]
JP1167  M01PTH_SMD_3.25X0.85MM_NO_SILK  [1X01_SMD_3.25X0.85MM_NO_SILK]
JP1168  M01PTH_SMD_3.25X0.85MM_NO_SILK  [1X01_SMD_3.25X0.85MM_NO_SILK]
JP1169  M01PTH_SMD_3.25X0.85MM_NO_SILK  [1X01_SMD_3.25X0.85MM_NO_SILK]
JP1170  M01PTH_SMD_3.25X0.85MM_NO_SILK  [1X01_SMD_3.25X0.85MM_NO_SILK]
JP1171  M01PTH_SMD_3.25X0.85MM_NO_SILK  [1X01_SMD_3.25X0.85MM_NO_SILK]
JP1172  M01PTH_SMD_3.25X0.85MM_NO_SILK  [1X01_SMD_3.25X0.85MM_NO_SILK]
JP1173  M01PTH_SMD_3.25X0.85MM_NO_SILK  [1X01_SMD_3.25X0.85MM_NO_SILK]
JP1174  M01PTH_SMD_3.25X0.85MM_NO_SILK  [1X01_SMD_3.25X0.85MM_NO_SILK]
JP1175  M01PTH_SMD_3.25X0.85MM_NO_SILK  [1X01_SMD_3.25X0.85MM_NO_SILK]
JP1176  M01PTH_SMD_3.25X0.85MM_NO_SILK  [1X01_SMD_3.25X0.85MM_NO_SILK]
JP1177  M01PTH_SMD_3.25X0.85MM_NO_SILK  [1X01_SMD_3.25X0.85MM_NO_SILK]
JP1178  M01PTH_SMD_3.25X0.85MM_NO_SILK  [1X01_SMD_3.25X0.85MM_NO_SILK]
JP1179  M01PTH_SMD_3.25X0.85MM_NO_SILK  [1X01_SMD_3.25X0.85MM_NO_SILK]
JP1180  M01PTH_SMD_3.25X0.85MM_NO_SILK  [1X01_SMD_3.25X0.85MM_NO_SILK]
JP1181  M01PTH_SMD_3.25X0.85MM_NO_SILK  [1X01_SMD_3.25X0.85MM_NO_SILK]
JP1182  M01PTH_SMD_3.25X0.85MM_NO_SILK  [1X01_SMD_3.25X0.85MM_NO_SILK]
JP1183  M01PTH_SMD_3.25X0.85MM_NO_SILK  [1X01_SMD_3.25X0.85MM_NO_SILK]
JP1184  M01PTH_SMD_3.25X0.85MM_NO_SILK  [1X01_SMD_3.25X0.85MM_NO_SILK]
JP1185  M01PTH_SMD_3.25X0.85MM_NO_SILK  [1X01_SMD_3.25X0.85MM_NO_SILK]
JP1186  M01PTH_SMD_3.25X0.85MM_NO_SILK  [1X01_SMD_3.25X0.85MM_NO_SILK]
JP1187  M01PTH_SMD_3.25X0.85MM_NO_SILK  [1X01_SMD_3.25X0.85MM_NO_SILK]
JP1188  M01PTH_SMD_3.25X0.85MM_NO_SILK  [1X01_SMD_3.25X0.85MM_NO_SILK]
JP1189  M01PTH_SMD_3.25X0.85MM_NO_SILK  [1X01_SMD_3.25X0.85MM_NO_SILK]
JP1190  M01PTH_SMD_3.25X0.85MM_NO_SILK  [1X01_SMD_3.25X0.85MM_NO_SILK]
JP1191  M01PTH_SMD_3.25X0.85MM_NO_SILK  [1X01_SMD_3.25X0.85MM_NO_SILK]
JP1192  M01PTH_SMD_3.25X0.85MM_NO_SILK  [1X01_SMD_3.25X0.85MM_NO_SILK]
JP1193  M01PTH_SMD_3.25X0.85MM_NO_SILK  [1X01_SMD_3.25X0.85MM_NO_SILK]
JP1194  M01PTH_SMD_3.25X0.85MM_NO_SILK  [1X01_SMD_3.25X0.85MM_NO_SILK]
JP1195  M01PTH_SMD_3.25X0.85MM_NO_SILK  [1X01_SMD_3.25X0.85MM_NO_SILK]
JP1196  M01PTH_SMD_3.25X0.85MM_NO_SILK  [1X01_SMD_3.25X0.85MM_NO_SILK]
JP1197  M01PTH_SMD_3.25X0.85MM_NO_SILK  [1X01_SMD_3.25X0.85MM_NO_SILK]
JP1198  M01PTH_SMD_3.25X0.85MM_NO_SILK  [1X01_SMD_3.25X0.85MM_NO_SILK]
JP1199  M01PTH_SMD_3.25X0.85MM_NO_SILK  [1X01_SMD_3.25X0.85MM_NO_SILK]
JP1200  M01PTH_SMD_3.25X0.85MM_NO_SILK  [1X01_SMD_3.25X0.85MM_NO_SILK]
Unconnected: JP1.1 JP2.1 JP3.1 JP4.1 JP5.1 JP6.1 JP7.1 JP8.1 JP9.1 JP10.1 JP11.1 JP12.1 JP13.1 JP14.1 JP15.1 JP16.1 JP17.1 JP18.1 JP19.1 JP20.1 JP21.1 JP22.1 JP23.1 JP24.1 JP25.1 JP26.1 JP27.1 JP28.1 JP29.1 JP30.1 JP31.1 JP32.1 JP33.1 JP34.1 JP35.1 JP36.1 JP37.1 JP38.1 JP39.1 JP40.1 JP41.1 JP42.1 JP43.1 JP44.1 JP45.1 JP46.1 JP47.1 JP48.1 JP49.1 JP50.1 JP51.1 JP52.1 JP53.1 JP54.1 JP55.1 JP56.1 JP57.1 JP58.1 JP59.1 JP60.1 JP61.1 JP62.1 JP63.1 JP64.1 JP65.1 JP66.1 JP67.1 JP68.1 JP69.1 JP70.1 JP71.1 JP72.1 JP73.1 JP74.1 JP75.1 JP76.1 JP77.1 JP78.1 JP79.1 JP80.1 JP81.1 JP82.1 JP83.1 JP84.1 JP85.1 JP86.1 JP87.1 JP88.1 JP89.1 JP90.1 JP91.1 JP92.1 JP93.1 JP94.1 JP95.1 JP96.1 JP97.1 JP98.1 JP99.1 JP100.1 JP101.1 JP102.1 JP103.1 JP104.1 JP105.1 JP106.1 JP107.1 JP108.1 JP109.1 JP110.1 JP111.1 JP112.1 JP113.1 JP114.1 JP115.1 JP116.1 JP117.1 JP118.1 JP119.1 JP120.1 JP121.1 JP122.1 JP123.1 JP124.1 JP125.1 JP126.1 JP127.1 JP128.1 JP129.1 JP130.1 JP131.1 JP132.1 JP133.1 JP134.1 JP135.1 JP136.1 JP137.1 JP138.1 JP139.1 JP140.1 JP141.1 JP142.1 JP143.1 JP144.1 JP145.1 JP146.1 JP147.1 JP148.1 JP149.1 JP150.1 JP151.1 JP152.1 JP153.1 JP154.1 JP155.1 JP156.1 JP157.1 JP158.1 JP159.1 JP160.1 JP161.1 JP162.1 JP163.1 JP164.1 JP165.1 JP166.1 JP167.1 JP168.1 JP169.1 JP170.1 JP171.1 JP172.1 JP173.1 JP174.1 JP175.1 JP176.1 JP177.1 JP178.1 JP179.1 JP180.1 JP181.1 JP182.1 JP183.1 JP184.1 JP185.1 JP186.1 JP187.1 JP188.1 JP189.1 JP190.1 JP191.1 JP192.1 JP193.1 JP194.1 JP195.1 JP196.1 JP197.1 JP198.1 JP199.1 JP200.1 JP201.1 JP202.1 JP203.1 JP204.1 JP205.1 JP206.1 JP207.1 JP208.1 JP209.1 JP210.1 JP211.1 JP212.1 JP213.1 JP214.1 JP215.1 JP216.1 JP217.1 JP218.1 JP219.1 JP220.1 JP221.1 JP222.1 JP223.1 JP224.1 JP225.1 JP226.1 JP227.1 JP228.1 JP229.1 JP230.1 JP231.1 JP232.1 JP233.1 JP234.1 JP235.1 JP236.1 JP237.1 JP238.1 JP239.1 JP240.1 JP241.1 JP242.1 JP243.1 JP244.1 JP245.1 JP246.1 JP247.1 JP248.1 JP249.1 JP250.1 JP251.1 JP252.1 JP253.1 JP254.1 JP255.1 JP256.1 JP257.1 JP258.1 JP259.1 JP260.1 JP261.1 JP262.1 JP263.1 JP264.1 JP265.1 JP266.1 JP267.1 JP268.1 JP269.1 JP270.1 JP271.1 JP272.1 JP273.1 JP274.1 JP275.1 JP276.1 JP277.1 JP278.1 JP279.1 JP280.1 JP281.1 JP282.1 JP283.1 JP284.1 JP285.1 JP286.1 JP287.1 JP288.1 JP289.1 JP290.1 JP291.1 JP292.1 JP293.1 JP294.1 JP295.1 JP296.1 JP297.1 JP298.1 JP299.1 JP300.1 JP901.P$3 JP902.P$3 JP903.P$3 JP904.P$3 JP905.P$3 JP906.P$3 JP907.P$3 JP908.P$3 JP909.P$3 JP910.P$3 JP911.P$3 JP912.P$3 JP913.P$3 JP914.P$3 JP915.P$3 JP916.P$3 JP917.P$3 JP918.P$3 JP919.P$3 JP920.P$3 JP921.P$3 JP922.P$3 JP923.P$3 JP924.P$3 JP925.P$3 JP926.P$3 JP927.P$3 JP928.P$3 JP929.P$3 JP930.P$3 JP931.P$3 JP932.P$3 JP933.P$3 JP934.P$3 JP935.P$3 JP936.P$3 JP937.P$3 JP938.P$3 JP939.P$3 JP940.P$3 JP941.P$3 JP942.P$3 JP943.P$3 JP944.P$3 JP945.P$3 JP946.P$3 JP947.P$3 JP948.P$3 JP949.P$3 JP950.P$3 JP951.P$3 JP952.P$3 JP953.P$3 JP954.P$3 JP955.P$3 JP956.P$3 JP957.P$3 JP958.P$3 JP959.P$3 JP960.P$3 JP961.P$3 JP962.P$3 JP963.P$3 JP964.P$3 JP965.P$3 JP966.P$3 JP967.P$3 JP968.P$3 JP969.P$3 JP970.P$3 JP971.P$3 JP972.P$3 JP973.P$3 JP974.P$3 JP975.P$3 JP976.P$3 JP977.P$3 JP978.P$3 JP979.P$3 JP980.P$3 JP981.P$3 JP982.P$3 JP983.P$3 JP984.P$3 JP985.P$3 JP986.P$3 JP987.P$3 JP988.P$3 JP989.P$3 JP990.P$3 JP991.P$3 JP992.P$3 JP993.P$3 JP994.P$3 JP995.P$3 JP996.P$3 JP997.P$3 JP998.P$3 JP999.P$3 JP1000.P$3 JP1001.P$3 JP1002.P$3 JP1003.P$3 JP1004.P$3 JP1005.P$3 JP1006.P$3 JP1007.P$3 JP1008.P$3 JP1009.P$3 JP1010.P$3 JP1011.P$3 JP1012.P$3 JP1013.P$3 JP1014.P$3 JP1015.P$3 JP1016.P$3 JP1017.P$3 JP1018.P$3 JP1019.P$3 JP1020.P$3 JP1021.P$3 JP1022.P$3 JP1023.P$3 JP1024.P$3 JP1025.P$3 JP1026.P$3 JP1027.P$3 JP1028.P$3 JP1029.P$3 JP1030.P$3 JP1031.P$3 JP1032.P$3 JP1033.P$3 JP1034.P$3 JP1035.P$3 JP1036.P$3 JP1037.P$3 JP1038.P$3 JP1039.P$3 JP1040.P$3 JP1041.P$3 JP1042.P$3 JP1043.P$3 JP1044.P$3 JP1045.P$3 JP1046.P$3 JP1047.P$3 JP1048.P$3 JP1049.P$3 JP1050.P$3 JP1051.P$3 JP1052.P$3 JP1053.P$3 JP1054.P$3 JP1055.P$3 JP1056.P$3 JP1057.P$3 JP1058.P$3 JP1059.P$3 JP1060.P$3 JP1061.P$3 JP1062.P$3 JP1063.P$3 JP1064.P$3 JP1065.P$3 JP1066.P$3 JP1067.P$3 JP1068.P$3 JP1069.P$3 JP1070.P$3 JP1071.P$3 JP1072.P$3 JP1073.P$3 JP1074.P$3 JP1075.P$3 JP1076.P$3 JP1077.P$3 JP1078.P$3 JP1079.P$3 JP1080.P$3 JP1081.P$3 JP1082.P$3 JP1083.P$3 JP1084.P$3 JP1085.P$3 JP1086.P$3 JP1087.P$3 JP1088.P$3 JP1089.P$3 JP1090.P$3 JP1091.P$3 JP1092.P$3 JP1093.P$3 JP1094.P$3 JP1095.P$3 JP1096.P$3 JP1097.P$3 JP1098.P$3 JP1099.P$3 JP1100.P$3 JP1101.P$3 JP1102.P$3 JP1103.P$3 JP1104.P$3 JP1105.P$3 JP1106.P$3 JP1107.P$3 JP1108.P$3 JP1109.P$3 JP1110.P$3 JP1111.P$3 JP1112.P$3 JP1113.P$3 JP1114.P$3 JP1115.P$3 JP1116.P$3 JP1117.P$3 JP1118.P$3 JP1119.P$3 JP1120.P$3 JP1121.P$3 JP1122.P$3 JP1123.P$3 JP1124.P$3 JP1125.P$3 JP1126.P$3 JP1127.P$3 JP1128.P$3 JP1129.P$3 JP1130.P$3 JP1131.P$3 JP1132.P$3 JP1133.P$3 JP1134.P$3 JP1135.P$3 JP1136.P$3 JP1137.P$3 JP1138.P$3 JP1139.P$3 JP1140.P$3 JP1141.P$3 JP1142.P$3 JP1143.P$3 JP1144.P$3 JP1145.P$3 JP1146.P$3 JP1147.P$3 JP1148.P$3 JP1149.P$3 JP1150.P$3 JP1151.P$3 JP1152.P$3 JP1153.P$3 JP1154.P$3 JP1155.P$3 JP1156.P$3 JP1157.P$3 JP1158.P$3 JP1159.P$3 JP1160.P$3 JP1161.P$3 JP1162.P$3 JP1163.P$3 JP1164.P$3 JP1165.P$3 JP1166.P$3 JP1167.P$3 JP1168.P$3 JP1169.P$3 JP1170.P$3 JP1171.P$3 JP1172.P$3 JP1173.P$3 JP1174.P$3 JP1175.P$3 JP1176.P$3 JP1177.P$3 JP1178.P$3 JP1179.P$3 JP1180.P$3 JP1181.P$3 JP1182.P$3 JP1183.P$3 JP1184.P$3 JP1185.P$3 JP1186.P$3 JP1187.P$3 JP1188.P$3 JP1189.P$3 JP1190.P$3 JP1191.P$3 JP1192.P$3 JP1193.P$3 JP1194.P$3 JP1195.P$3 JP1196.P$3 JP1197.P$3 JP1198.P$3 JP1199.P$3 JP1200.P$3

## Library data of the parts
JP1-JP300 JP901-JP1200 = SparkFun-Connectors:M01: Header 1 Standard 1-pin 0.1" header. Use with straight break away headers (SKU : PRT-00116), right angle break away headers (PRT-00553), swiss pins (PRT-00743), machine pins (PRT-00117), and female headers (PRT-00115).